# Altium project MainBoard.PrjPcb (part 1 of 3)
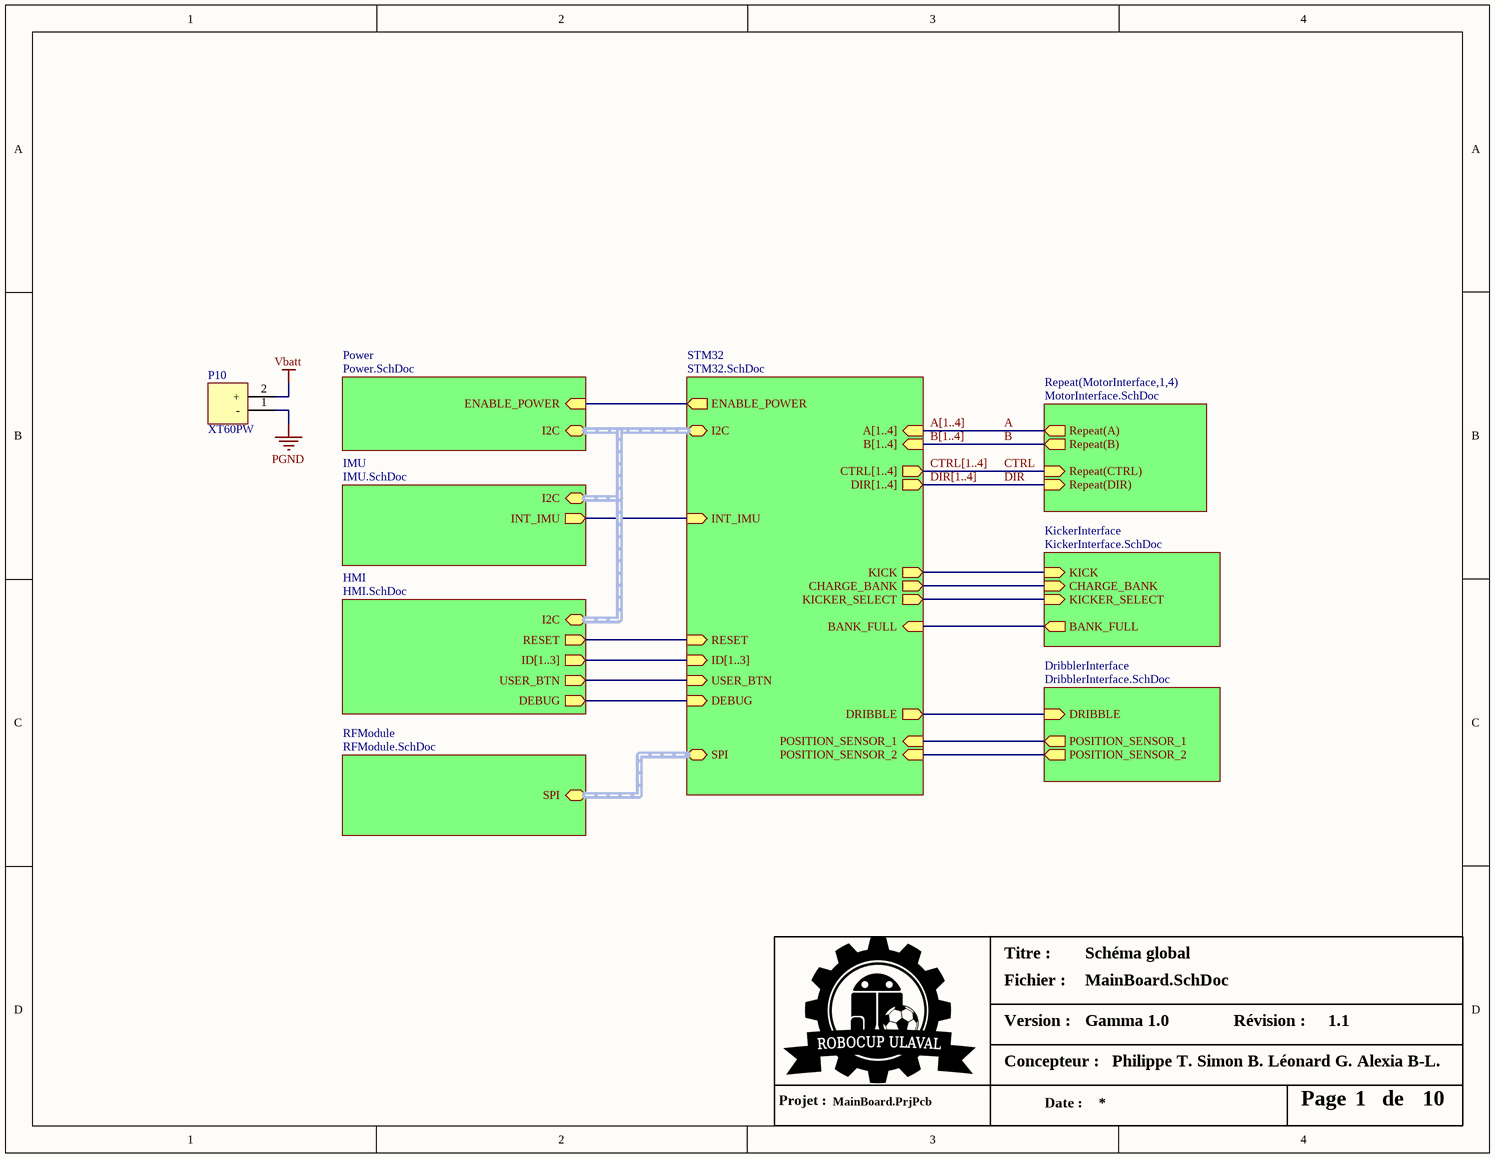
[diagram p0: MainBoard.SchDoc]
10 sheets, 173 parts. Net scope: hierarchical (ports join the sheet entries above them; power ports are global).
Board file: PCB_MainBoard.PcbDoc
Sheets:
  MainBoard.SchDoc
    Power = Power.SchDoc
    MotorInterface1 = MotorInterface.SchDoc
    MotorInterface2 = MotorInterface.SchDoc
    MotorInterface3 = MotorInterface.SchDoc
    MotorInterface4 = MotorInterface.SchDoc
    KickerInterface = KickerInterface.SchDoc
    DribblerInterface = DribblerInterface.SchDoc
    HMI = HMI.SchDoc
    IMU = IMU.SchDoc
    RFModule = RFModule.SchDoc
    STM32 = STM32.SchDoc
      MCU = MCU.SchDoc

## Sheet MainBoard.SchDoc: Schéma global
size Letter; Organization: Robocup Ulaval; DocumentNumber: 1; Revision: 1.1; SheetNumber: 1; SheetTotal: 10; Version: Gamma 1.0; Conceptor: Philippe T. Simon B. Léonard G. Alexia B-L.

### Parts
P10  XT60PW  [XT60PW]

### Sub-sheets
DribblerInterface = DribblerInterface.SchDoc: DRIBBLE (in), POSITION_SENSOR_2 (out), POSITION_SENSOR_1 (out)
HMI = HMI.SchDoc: I2C (harness I2C), ID[1..3] (out), RESET (out), USER_BTN (out), DEBUG (out)
IMU = IMU.SchDoc: I2C (harness I2C), INT_IMU (out)
KickerInterface = KickerInterface.SchDoc: KICK (in), BANK_FULL (out), CHARGE_BANK (in), KICKER_SELECT (in)
Power = Power.SchDoc: ENABLE_POWER (in), I2C (harness I2C)
Repeat(MotorInterface,1,4) = MotorInterface.SchDoc: Repeat(A) (out), Repeat(B) (out), Repeat(CTRL) (in), Repeat(DIR) (in)
RFModule = RFModule.SchDoc: SPI (harness SPI)
STM32 = STM32.SchDoc: A[1..4] (in), B[1..4] (in), ID[1..3] (in), I2C (harness I2C), SPI (harness SPI), ENABLE_POWER (out), CTRL[1..4] (out), DIR[1..4] (out), KICK (out), BANK_FULL (in), CHARGE_BANK (out), POSITION_SENSOR_1 (in), POSITION_SENSOR_2 (in), DRIBBLE (out), RESET (in), INT_IMU (in), KICKER_SELECT (out), USER_BTN (in), DEBUG (in)

### Nets
PGND: P10.1(-)
Vbatt: P10.2(+)
A: sheet Repeat(MotorInterface,1,4)/Repeat(A)
B: sheet Repeat(MotorInterface,1,4)/Repeat(B)
BANK_FULL: sheet KickerInterface/BANK_FULL, sheet STM32/BANK_FULL
CHARGE_BANK: sheet KickerInterface/CHARGE_BANK, sheet STM32/CHARGE_BANK
CTRL: sheet Repeat(MotorInterface,1,4)/Repeat(CTRL)
DEBUG: sheet HMI/DEBUG, sheet STM32/DEBUG
DIR: sheet Repeat(MotorInterface,1,4)/Repeat(DIR)
DRIBBLE: sheet DribblerInterface/DRIBBLE, sheet STM32/DRIBBLE
ENABLE_POWER: sheet Power/ENABLE_POWER, sheet STM32/ENABLE_POWER
IMU_IRQ: sheet IMU/INT_IMU, sheet STM32/INT_IMU
KICK: sheet KickerInterface/KICK, sheet STM32/KICK
KICKER_SELECT: sheet KickerInterface/KICKER_SELECT, sheet STM32/KICKER_SELECT
POSITION_SENSOR_1: sheet DribblerInterface/POSITION_SENSOR_1, sheet STM32/POSITION_SENSOR_1
POSITION_SENSOR_2: sheet DribblerInterface/POSITION_SENSOR_2, sheet STM32/POSITION_SENSOR_2
RESET: sheet HMI/RESET, sheet STM32/RESET
USER_BTN: sheet HMI/USER_BTN, sheet STM32/USER_BTN

### Buses and harness runs
bus A[1..4] = sheet STM32/A[1..4]
bus B[1..4] = sheet STM32/B[1..4]
bus CTRL[1..4] = sheet STM32/CTRL[1..4]
bus DIR[1..4] = sheet STM32/DIR[1..4]
bus sheet HMI/ID[1..3] = sheet STM32/ID[1..3]
harness sheet HMI/I2C = sheet IMU/I2C = sheet Power/I2C = sheet STM32/I2C
harness sheet RFModule/SPI = sheet STM32/SPI

### Notes on the sheet
- Titre :
- Version :
- Fichier :
- Révision :
- Projet :
- Concepteur :
- Date :
- Page
- de

### Library data of the parts
P10 = XT60PW: XT60PW connector

## Sheet Power.SchDoc: Power supply unit
size A4; Organization: Robocup Ulaval; DocumentNumber: 4; Revision: 1.0; SheetNumber: 4; SheetTotal: 10; Conceptor: Philippe T. Simon B. Léonard G. Alexia B-L.; Version: Gamma 1.0; PageSetup: Record=PageOptions|CenterHorizontal=True|CenterVertical=True|PrintScale=1.00|XCorrection=1.00|YCorrection=1.00|PrintKind=1|BorderSize=5000000|LeftOffset=0|BottomOffset=0|Orientation=2|PaperLength=1000|PaperWidth=1000|Scale=100|PaperSource=7|PrintQuality=-4|MediaType=1|DitherType=10|PaperKind=A4 Small|PrintScaleMode=1
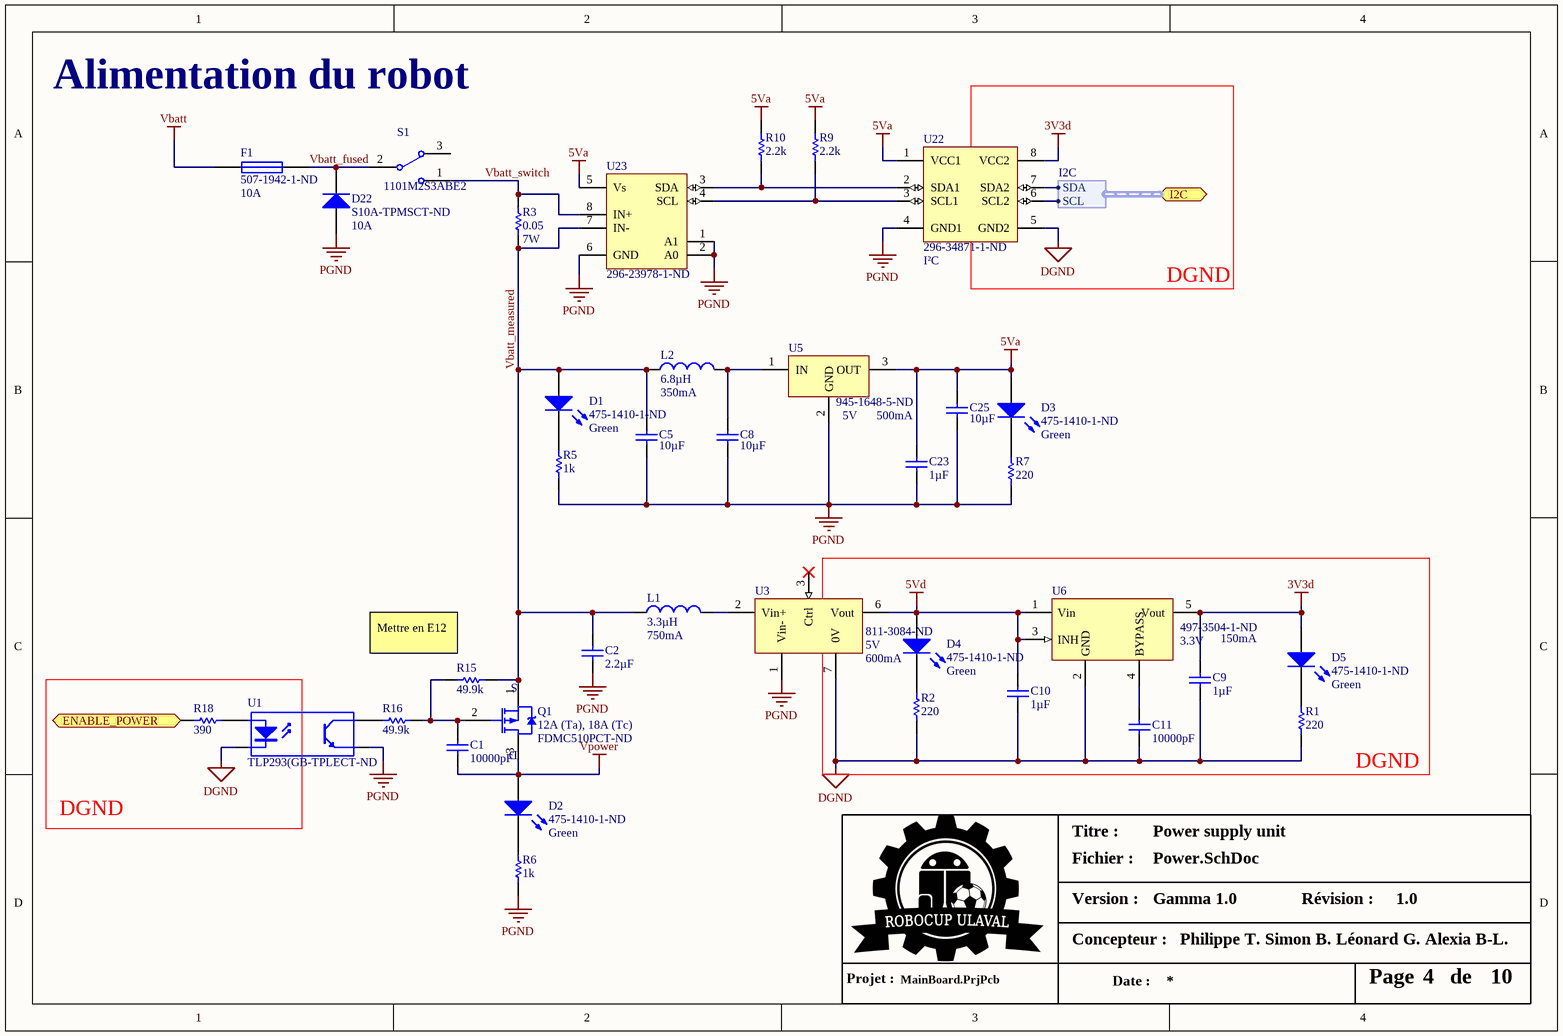
[diagram p1: Power.SchDoc]

### Parts
C1  Capacitance: 10000pF  [0603]  (hidden comment: GRM188R71H103KA01D)
C2  Capacitance: 2.2µF  [0805]  (hidden comment: CL21B225KAFNNWE)
C5  Capacitance: 10µF  [1206]  (hidden comment: GMK316AB7106KL-TR)
C8  Capacitance: 10µF  [1206]  (hidden comment: GMK316AB7106KL-TR)
C9  Capacitance: 1µF  [0805]  (hidden comment: CL21B105KBFNFNE)
C10  Capacitance: 1µF  [0805]  (hidden comment: CL21B105KBFNFNE)
C11  Capacitance: 10000pF  [0603]  (hidden comment: GRM188R71H103KA01D)
C23  Capacitance: 1µF  [0805]  (hidden comment: CL21B105KBFNFNE)
C25  Capacitance: 10µF  [1206]  (hidden comment: GMK316AB7106KL-TR)
D1  Supplier Part Number 1: 475-1410-1-ND  Color: Green  [0805]  (hidden comment: LG R971-KN-1)
D2  Supplier Part Number 1: 475-1410-1-ND  Color: Green  [0805]  (hidden comment: LG R971-KN-1)
D3  Supplier Part Number 1: 475-1410-1-ND  Color: Green  [0805]  (hidden comment: LG R971-KN-1)
D4  Supplier Part Number 1: 475-1410-1-ND  Color: Green  [0805]  (hidden comment: LG R971-KN-1)
D5  Supplier Part Number 1: 475-1410-1-ND  Color: Green  [0805]  (hidden comment: LG R971-KN-1)
D22  Supplier Part Number 1: S10A-TPMSCT-ND  Current - Average Rectified (Io): 10A  [SMC]  (hidden comment: S10A-TP)
F1  Supplier Part Number 1: 507-1942-1-ND  Current Rating: 10A  [1206]  (hidden comment: C1H 10)
L1  Inductance: 3.3µH  Current Rating: 750mA  [0805]  (hidden comment: MLZ2012N3R3LT000)
L2  Inductance: 6.8µH  Current Rating: 350mA  [0805]  (hidden comment: MLZ2012M6R8WT000)
Q1  Current - Continuous Drain (Id) @ 25°C: 12A (Ta), 18A (Tc)  Supplier Part Number 1: FDMC510PCT-ND  [PowerPAK 1212-8]  (hidden comment: FDMC510P)
R1  Resistance (Ohms): 220  [1206]  (hidden comment: RC1206JR-07220RL)
R2  Resistance (Ohms): 220  [1206]  (hidden comment: RC1206JR-07220RL)
R3  Resistance (Ohms): 0.05  Power (Watts): 7W  [RESC7146X15N]  (hidden comment: WSHM2818R0500FEA)
R5  Resistance (Ohms): 1k  [1206]  (hidden comment: RNCP1206FTD1K00)
R6  Resistance (Ohms): 1k  [1206]  (hidden comment: RC0603FR-072K2L)
R7  Resistance (Ohms): 220  [1206]  (hidden comment: RC1206JR-07220RL)
R9  Resistance (Ohms): 2.2k  [0603]  (hidden comment: RC0603FR-072K2L)
R10  Resistance (Ohms): 2.2k  [0603]  (hidden comment: RC0603FR-072K2L)
R15  Resistance (Ohms): 49.9k  [0603]  (hidden comment: RC0603FR-0749K9L)
R16  Resistance (Ohms): 49.9k  [0603]  (hidden comment: RC0603FR-0749K9L)
R18  Resistance (Ohms): 390  [0603]  (hidden comment: RC0603JR-07390RL)
S1  1101M2S3ABE2  [C&K Switch]
U1  Supplier Part Number 1: TLP293(GB-TPLECT-ND  [SOIC127P700X220-4N]  (hidden comment: TLP293(GB-TPL,E)
U3  Supplier Part Number 1: 811-3084-ND  Voltage - Output 1: 5V  Current - Output (Max): 600mA  [NCS3S]  (hidden comment: NCS3S1205SC)
U5  Supplier Part Number 1: 945-1648-5-ND  Voltage - Output 1: 5V  Current - Output (Max): 500mA  [3-SIP MOdule]  (hidden comment: R-78E5.0-0.5)
U6  Supplier Part Number 1: 497-3504-1-ND  Voltage - Output: 3.3V  Current - Output: 150mA  [SOT-23-5]  (hidden comment: LD3985M33R)
U22  Supplier Part Number 1: 296-34871-1-ND  Type: I²C  [SOIC127P600X175-8N]  (hidden comment: ISO1540DR)
U23  Supplier Part Number 1: 296-23978-1-ND  [SOIC127P600X175-8N]  (hidden comment: INA219AIDR)

### Blocks framed on the sheet
DGND: U22
DGND: C9-C11 D4 D5 R1 R2 U6
DGND: R18

### Ports
ENABLE_POWER (in), I2C (harness I2C)

### Harnesses
I2C: SCL, SDA

### Nets
3V3d: C9.2 D5.1(A) U6.5(Vout) U22.8(VCC2)
5Va: C23.2 C25.2 D3.1(A) R9.2 R10.2 U5.3(OUT) U22.1(VCC1) U23.5(Vs)
5Vd: C10.2 D4.1(A) U3.6(Vout) U6.1(Vin) U6.3(INH)
DGND: C9.1 C10.1 C11.1 R1.1 R2.1 U1.2(K) U3.7(0V) U6.2(GND) U22.5(GND2)
PGND: C2.1 C5.1 C8.1 C23.1 C25.1 D22.1(A) R5.1 R6.1 R7.1 U1.3(E) U3.1(Vin-) U5.2(GND) U22.4(GND1) U23.1(A1) U23.2(A0) U23.6(GND)
Vbatt: F1.1
Vpower: C1.1 D2.1(A) Q1.3(D)
ENABLE_POWER: R18.1 ; port ENABLE_POWER
SCL: U22.6(SCL2) ; port I2C.SCL
SDA: U22.7(SDA2) ; port I2C.SDA
Vbatt_fused: D22.2(K) F1.2 S1.2
Vbatt_measured: C2.2 C5.2 D1.1(A) L1.1 L2.1 Q1.1(S) R3.1 R15.2 U23.7(IN-)
Vbatt_switch: R3.2 S1.1 U23.8(IN+)
NetC1_2: C1.2 Q1.2(G) R15.1 R16.2
NetC8_2: C8.2 L2.2 U5.1(IN)
NetC11_2: C11.2 U6.4(BYPASS)
NetD1_2: D1.2(K) R5.2
NetD2_2: D2.2(K) R6.2
NetD3_2: D3.2(K) R7.2
NetD4_2: D4.2(K) R2.2
NetD5_2: D5.2(K) R1.2
NetL1_2: L1.2 U3.2(Vin+)
NetR9_1: R9.1 U22.3(SCL1) U23.4(SCL)
NetR10_1: R10.1 U22.2(SDA1) U23.3(SDA)
NetR16_1: R16.1 U1.4(C)
NetR18_2: R18.2 U1.1(A)

Not connected (* = marked no-connect by the designer): S1 3; U3 3(Ctrl)*

### Notes on the sheet
- Alimentation du robot
- (near R15) Mettre en E12
- Titre :
- Version :
- Fichier :
- Révision :
- Projet :
- Concepteur :
- Date :
- Page
- de

### Library data of the parts
C1 C11 = GRM188R71H103KA01D: CAP CER 10000PF 50V X7R 0603; Manufacturer: Murata Electronics North America; Tolerance: ±10%; Supplier 1: Digi-Key; Manufacturer Part Number: GRM188R71H103KA01D; RoHS: RoHS Compliant; Category: Capacitors; Stock 1: 3064909; Pricing 1: 1=0.14, 10=0.027, 50=0.0142, 100=0.0121, 250=0.00988, 500=0.00848, 1000=0.00661 (CAD); Packaging: Cut Tape (CT); Voltage - Rated: 50V; Temperature Coefficient: X7R; Mounting Type: Surface Mount, MLCC; Operating Temperature: -55°C ~ 125°C; Applications: General Purpose; Ratings: -; Package / Case: 0603 (1608 Metric); Size / Dimension: 0.063" L x 0.031" W (1.60mm x 0.80mm); Height - Seated (Max): -; Thickness (Max): 0.035" (0.90mm); Lead Spacing: -; Features: -; Lead Style: -; ComponentLink1URL: http://www.murata.com/~/media/webrenewal/support/library/catalog/products/capacitor/mlcc/c02e.pdf; ComponentLink1Description: http://www.murata.com/~/media/webrenewal/support/library/catalog/products/capacitor/mlcc/c02e.pdf; Supplier Part Number 1: 490-1512-1-ND
C2 = CL21B225KAFNNWE: CAP CER 2.2UF 25V X7R 0805; Manufacturer: Samsung Electro-Mechanics America, Inc.; Tolerance: ±10%; Supplier 1: Digi-Key; Supplier Part Number 1: 1276-2955-1-ND; Manufacturer Part Number: CL21B225KAFNNWE; RoHS: RoHS Compliant; Category: Capacitors; Stock 1: 66081; Pricing 1: 1=0.3, 10=0.199, 25=0.1452, 50=0.1208, 100=0.1015, 500=0.07252, 1000=0.06163 (CAD); Packaging: Cut Tape (CT); Voltage - Rated: 25V; Temperature Coefficient: X7R; Mounting Type: Surface Mount, MLCC; Operating Temperature: -55°C ~ 125°C; Applications: General Purpose; Ratings: -; Package / Case: 0805 (2012 Metric); Size / Dimension: 0.079" L x 0.049" W (2.00mm x 1.25mm); Height - Seated (Max): -; Thickness (Max): 0.053" (1.35mm); Lead Spacing: -; Features: -; Lead Style: -; ComponentLink1URL: http://media.digikey.com/pdf/Data%20Sheets/Samsung%20PDFs/CL21B225KAFNNWE_Spec.pdf; ComponentLink1Description: http://media.digikey.com/pdf/Data%20Sheets/Samsung%20PDFs/CL21B225KAFNNWE_Spec.pdf
C5 C8 C25 = GMK316AB7106KL-TR: CAP CER 10UF 35V X7R 1206; Manufacturer: Taiyo Yuden; Tolerance: ±10%; Supplier 1: Digi-Key; Supplier Part Number 1: 587-3007-1-ND; Manufacturer Part Number: GMK316AB7106KL-TR; RoHS: RoHS Compliant; Category: Capacitors; Stock 1: 108706; Pricing 1: 1=0.84, 10=0.697, 50=0.4996, 100=0.4371, 250=0.34344, 500=0.31222, 1000=0.24978 (CAD); Packaging: Cut Tape (CT); Voltage - Rated: 35V; Temperature Coefficient: X7R; Mounting Type: Surface Mount, MLCC; Operating Temperature: -55°C ~ 125°C; Applications: General Purpose; Ratings: -; Package / Case: 1206 (3216 Metric); Size / Dimension: 0.126" L x 0.063" W (3.20mm x 1.60mm); Height - Seated (Max): -; Thickness (Max): 0.071" (1.80mm); Lead Spacing: -; Features: -; Lead Style: -; ComponentLink1URL: http://media.digikey.com/pdf/Data%20Sheets/Taiyo%20Yuden%20PDFs%20URL%20links/GMK316AB7106KL-TR_ProdSpec.pdf; ComponentLink1Description: http://media.digikey.com/pdf/Data%20Sheets/Taiyo%20Yuden%20PDFs%20URL%20links/GMK316AB7106KL-TR_ProdSpec.pdf
C9 C10 C23 = CL21B105KBFNFNE: CAP CER 1UF 50V X7R 0805; Manufacturer: Samsung Electro-Mechanics America, Inc.; Tolerance: ±10%; Supplier 1: Digi-Key; Manufacturer Part Number: CL21B105KBFNFNE; RoHS: RoHS Compliant; Stock 1: 21699; Pricing 1: 1=0.27, 10=0.186, 25=0.14, 50=0.1072, 100=0.0884, 500=0.06238, 1000=0.05123 (CAD); Packaging: Cut Tape (CT); Voltage - Rated: 50V; Temperature Coefficient: X7R; Mounting Type: Surface Mount, MLCC; Operating Temperature: -55°C ~ 125°C; Applications: General Purpose; Ratings: -; Package / Case: 0805 (2012 Metric); Size / Dimension: 0.079" L x 0.049" W (2.00mm x 1.25mm); Height - Seated (Max): -; Thickness (Max): 0.053" (1.35mm); Lead Spacing: -; Features: -; Lead Style: -; ComponentLink1URL: http://www.samsungsem.com/kr/support/product-search/mlcc/CL21B105KBFNFNE.jsp; ComponentLink1Description: http://www.samsungsem.com/kr/support/product-search/mlcc/CL21B105KBFNFNE.jsp; Supplier Part Number 1: 1276-2928-1-ND; Category: Capacitors
D1-D5 = LG R971-KN-1: LED GREEN DIFFUSED 0805 SMD; Manufacturer: OSRAM Opto Semiconductors Inc.; Lens Color: White; Millicandela Rating: 26.05mcd; Lens Style/Size: Rectangle with Flat Top, 1.30mm x 1.25mm; Voltage - Forward (Vf) (Typ): 2.2V; Current - Test: 20mA; Viewing Angle: 160°; Wavelength - Dominant: 570nm; Wavelength - Peak: 572nm; Supplier 1: Digi-Key; Manufacturer Part Number: LG R971-KN-1; RoHS: RoHS Compliant; Category: Optoelectronics; Stock 1: 315869; Pricing 1: 1=0.37, 10=0.267, 25=0.1972, 100=0.141, 250=0.09588, 500=0.0846, 1000=0.06626 (CAD); Packaging: Cut Tape (CT); Lens Transparency: Diffused; Mounting Type: Surface Mount; Features: -; Package / Case: 0805 (2012 Metric); Supplier Device Package: *; Size / Dimension: 2.00mm L x 1.25mm W; Height (Max): 0.90mm; ComponentLink1URL: http://www.osram-os.com/Graphics/XPic9/00078860_0.pdf; ComponentLink1Description: http://www.osram-os.com/Graphics/XPic9/00078860_0.pdf
D22 = S10A-TP: DIODE GEN PURP 50V 10A DO214AB; Manufacturer: Micro Commercial Co; Diode Type: Standard; Voltage - Forward (Vf) (Max) @ If: 1.2V @ 10A; Speed: Standard Recovery >500ns, > 200mA (Io); Current - Reverse Leakage @ Vr: 10µA @ 50V; Supplier 1: Digi-Key; Manufacturer Part Number: S10A-TP; RoHS: RoHS Compliant; Category: Discrete Semiconductor Products; Stock 1: 16594; Pricing 1: 1=0.88, 10=0.769, 25=0.6808, 100=0.5932, 250=0.51624, 500=0.43934 (CAD); Packaging: Cut Tape (CT); Voltage - DC Reverse (Vr) (Max): 50V; Reverse Recovery Time (trr): -; Capacitance @ Vr, F: -; Mounting Type: Surface Mount; Package / Case: DO-214AB, SMC; Supplier Device Package: DO-214AB, (SMC); Operating Temperature - Junction: -55°C ~ 150°C; ComponentLink1URL: http://www.mccsemi.com/up_pdf/S10A~S10M(HSMC).PDF; ComponentLink1Description: http://www.mccsemi.com/up_pdf/S10A~S10M(HSMC).PDF
F1 = C1H 10: FUSE BOARD MNT 10A 125VAC 32VDC; Manufacturer: Bel Fuse Inc.; Fuse Type: Board Mount (Cartridge Style Excluded); Voltage Rating - AC: 125V; Voltage Rating - DC: 32V; Response Time: Fast; Breaking Capacity @ Rated Voltage: 150A; Melting I²t: 5.9; Approvals: cURus; DC Cold Resistance: 0.0039 Ohm; Supplier 1: Digi-Key; Manufacturer Part Number: C1H 10; RoHS: RoHS Compliant; Category: Circuit Protection; Stock 1: 8694; Pricing 1: 1=0.47, 10=0.438, 25=0.4036, 100=0.363, 250=0.3232, 500=0.26932, 1000=0.25521, 2500=0.22828 (CAD); Packaging: Cut Tape (CT); Package / Case: 1206 (3216 Metric); Mounting Type: Surface Mount; Operating Temperature: -55°C ~ 125°C; Color: -; Size / Dimension: 0.126" L x 0.062" W x 0.026" H (3.20mm x 1.58mm x 0.65mm); ComponentLink1URL: http://belfuse.com/pdfs/C1H.pdf; ComponentLink1Description: http://belfuse.com/pdfs/C1H.pdf
L1 = MLZ2012N3R3LT000: FIXED IND 3.3UH 750MA 150 MOHM; Manufacturer: TDK Corporation; Type: Multilayer; Material - Core: Ferrite; Tolerance: ±20%; Current - Saturation: 130mA; Shielding: Shielded; DC Resistance (DCR): 195 mOhm Max; Frequency - Self Resonant: 90MHz; Frequency - Test: 2MHz; Supplier 1: Digi-Key; Supplier Part Number 1: 445-6759-1-ND; Manufacturer Part Number: MLZ2012N3R3LT000; RoHS: RoHS Compliant; Category: Inductors, Coils, Chokes; Stock 1: 9368; Pricing 1: 1=0.21, 10=0.189, 50=0.1478, 100=0.1325, 500=0.11356, 1000=0.09841 (CAD); Packaging: Cut Tape (CT); Q @ Freq: -; Ratings: -; Operating Temperature: -55°C ~ 125°C; Mounting Type: Surface Mount; Package / Case: 0805 (2012 Metric); Size / Dimension: 0.079" L x 0.049" W (2.00mm x 1.25mm); Height - Seated (Max): 0.041" (1.05mm); ComponentLink1URL: https://product.tdk.com/info/en/catalog/datasheets/inductor_commercial_decoupling_mlz2012_en.pdf; ComponentLink1Description: https://product.tdk.com/info/en/catalog/datasheets/inductor_commercial_decoupling_mlz2012_en.pdf
L2 = MLZ2012M6R8WT000: FIXED IND 6.8UH 350MA 400 MOHM; Manufacturer: TDK Corporation; Type: Multilayer; Material - Core: Ferrite; Tolerance: ±20%; Current - Saturation: 220mA; Shielding: Shielded; DC Resistance (DCR): 520 mOhm Max; Frequency - Test: 2MHz; Supplier 1: Digi-Key; Supplier Part Number 1: 445-6402-1-ND; Manufacturer Part Number: MLZ2012M6R8WT000; RoHS: RoHS Compliant; Category: Inductors, Coils, Chokes; Packaging: Tape & Reel (TR); Q @ Freq: -; Frequency - Self Resonant: -; Ratings: -; Operating Temperature: -55°C ~ 125°C; Mounting Type: Surface Mount; Package / Case: 0805 (2012 Metric); Size / Dimension: 0.079" L x 0.049" W (2.00mm x 1.25mm); Height - Seated (Max): 0.057" (1.45mm); ComponentLink1URL: https://product.tdk.com/info/en/catalog/datasheets/inductor_commercial_decoupling_mlz2012_en.pdf; ComponentLink1Description: https://product.tdk.com/info/en/catalog/datasheets/inductor_commercial_decoupling_mlz2012_en.pdf
Q1 = FDMC510P: MOSFET P-CH 20V 18A 8-MLP; Manufacturer: Fairchild Semiconductor; FET Type: MOSFET P-Channel, Metal Oxide; FET Feature: Standard; Rds On (Max) @ Id, Vgs: 8 mOhm @ 12A, 4.5V; Vgs(th) (Max) @ Id: 1V @ 250µA; Gate Charge (Qg) @ Vgs: 116nC @ 4.5V; Input Capacitance (Ciss) @ Vds: 7860pF @ 10V; Power - Max: 2.3W; Supplier 1: Digi-Key; Manufacturer Part Number: FDMC510P; RoHS: RoHS Compliant; Category: Discrete Semiconductor Products; Stock 1: 32424; Pricing 1: 1=2.03, 10=1.816, 100=1.4153, 500=1.17042, 1000=0.92559 (CAD); Packaging: Cut Tape (CT); Drain to Source Voltage (Vdss): 20V; Operating Temperature: -55°C ~ 150°C (TJ); Mounting Type: Surface Mount; Package / Case: 8-PowerWDFN; Supplier Device Package: 8-MLP (3.3x3.3); ComponentLink1URL: http://www.fairchildsemi.com/datasheets/FD/FDMC510P.pdf; ComponentLink1Description: http://www.fairchildsemi.com/datasheets/FD/FDMC510P.pdf
R1 R2 R7 = RC1206JR-07220RL: RES SMD 220 OHM 5% 1/4W 1206; Manufacturer: Yageo; Power (Watts): 0.25W, 1/4W; Temperature Coefficient: ±100ppm/°C; Supplier 1: Digi-Key; Manufacturer Part Number: RC1206JR-07220RL; RoHS: RoHS Compliant; Category: Resistors; Stock 1: 224548; Pricing 1: 1=0.15, 10=0.036, 25=0.0268, 100=0.015, 250=0.0114, 500=0.00912, 1000=0.00671, 2500=0.00582 (CAD); Packaging: Cut Tape (CT); Tolerance: ±5%; Composition: Thick Film; Features: Moisture Resistant; Operating Temperature: -55°C ~ 155°C; Package / Case: 1206 (3216 Metric); Supplier Device Package: 1206; Size / Dimension: 0.122" L x 0.063" W (3.10mm x 1.60mm); Height: 0.026" (0.65mm); Number of Terminations: 2; ComponentLink1URL: http://www.yageo.com/documents/recent/PYu-RC_Group_51_RoHS_L_04.pdf; ComponentLink1Description: http://www.yageo.com/documents/recent/PYu-RC_Group_51_RoHS_L_04.pdf; Supplier Part Number 1: 311-220ERCT-ND
R3 = WSHM2818R0500FEA: RES SMD 0.05 OHM 1% 7W 2818; Manufacturer: Vishay Dale; Temperature Coefficient: ±75ppm/°C; Supplier 1: Digi-Key; Supplier Part Number 1: 541-2633-1-ND; Manufacturer Part Number: WSHM2818R0500FEA; RoHS: RoHS Compliant; Category: Resistors; Stock 1: 1975; Pricing 1: 1=2.04, 10=1.808, 25=1.6612, 50=1.5156, 100=1.3116, 250=1.10756, 500=0.93264, 1000=0.77526 (CAD); Packaging: Cut Tape (CT); Tolerance: ±1%; Composition: Metal Element; Features: Automotive AEC-Q200, Current Sense, Moisture Resistant, Pulse Withstanding; Operating Temperature: -65°C ~ 170°C; Package / Case: 2818; Supplier Device Package: 2818; Size / Dimension: 0.280" L x 0.181" W (7.10mm x 4.60mm); Height: 0.069" (1.75mm); Number of Terminations: 2; ComponentLink1URL: http://www.vishay.com/docs/30188/wshm2818.pdf; ComponentLink1Description: http://www.vishay.com/docs/30188/wshm2818.pdf
R5 R6 = RNCP1206FTD1K00: RES SMD 1K OHM 1% 1/2W 1206; Manufacturer: Stackpole Electronics Inc.; Temperature Coefficient: ±100ppm/°C; Power (Watts): 0.5W, 1/2W; Supplier 1: Digi-Key; Manufacturer Part Number: RNCP1206FTD1K00; RoHS: RoHS Compliant; Category: Resistors; Stock 1: 13665; Pricing 1: 1=0.15, 10=0.074, 50=0.041, 100=0.0302, 250=0.02312, 500=0.01848, 1000=0.0136, 2500=0.0118 (CAD); Packaging: Cut Tape (CT); Part Status: Active; Tolerance: ±1%; Composition: Thin Film; Features: Anti-Sulfur, Moisture Resistant; Operating Temperature: -55°C ~ 155°C; Package / Case: 1206 (3216 Metric); Supplier Device Package: 1206; Size / Dimension: 0.122" L x 0.059" W (3.10mm x 1.50mm); Height: 0.024" (0.60mm); Number of Terminations: 2; Failure Rate: -; ComponentLink1URL: http://www.seielect.com/catalog/SEI-RNCP.pdf; ComponentLink1Description: http://www.seielect.com/catalog/SEI-RNCP.pdf; Supplier Part Number 1: RNCP1206FTD1K00CT-ND
R9 R10 = RC0603FR-072K2L: RES SMD 2.2K OHM 1% 1/10W 0603; Manufacturer: Yageo; Power (Watts): 0.1W, 1/10W; Temperature Coefficient: ±100ppm/°C; Supplier 1: Digi-Key; Manufacturer Part Number: RC0603FR-072K2L; RoHS: RoHS Compliant; Category: Resistors; Stock 1: 297758; Pricing 1: 1=0.15, 10=0.021, 25=0.0152, 100=0.0086, 250=0.0066, 500=0.00526, 1000=0.00389, 2500=0.00337 (CAD); Packaging: Cut Tape (CT); Tolerance: ±1%; Composition: Thick Film; Features: Moisture Resistant; Operating Temperature: -55°C ~ 155°C; Package / Case: 0603 (1608 Metric); Supplier Device Package: 0603; Size / Dimension: 0.063" L x 0.031" W (1.60mm x 0.80mm); Height: 0.022" (0.55mm); Number of Terminations: 2; ComponentLink1URL: http://www.yageo.com/documents/recent/PYu-RC_Group_51_RoHS_L_04.pdf; ComponentLink1Description: http://www.yageo.com/documents/recent/PYu-RC_Group_51_RoHS_L_04.pdf; Supplier Part Number 1: 311-2.20KHRCT-ND
R15 R16 = RC0603FR-0749K9L: RES SMD 49.9K OHM 1% 1/10W 0603; Manufacturer: Yageo; Power (Watts): 0.1W, 1/10W; Temperature Coefficient: ±100ppm/°C; Supplier 1: Digi-Key; Manufacturer Part Number: RC0603FR-0749K9L; RoHS: RoHS Compliant; Category: Resistors; Stock 1: 1514497; Pricing 1: 1=0.15, 10=0.021, 25=0.0152, 100=0.0086, 250=0.0066, 500=0.00526, 1000=0.00389, 2500=0.00337 (CAD); Packaging: Cut Tape (CT); Tolerance: ±1%; Composition: Thick Film; Features: Moisture Resistant; Operating Temperature: -55°C ~ 155°C; Package / Case: 0603 (1608 Metric); Supplier Device Package: 0603; Size / Dimension: 0.063" L x 0.031" W (1.60mm x 0.80mm); Height: 0.022" (0.55mm); Number of Terminations: 2; ComponentLink1URL: http://www.yageo.com/documents/recent/PYu-RC_Group_51_RoHS_L_04.pdf; ComponentLink1Description: http://www.yageo.com/documents/recent/PYu-RC_Group_51_RoHS_L_04.pdf; Supplier Part Number 1: 311-49.9KHRCT-ND
R18 = RC0603JR-07390RL: RES SMD 390 OHM 5% 1/10W 0603; Manufacturer: Yageo; Power (Watts): 0.1W, 1/10W; Temperature Coefficient: ±100ppm/°C; Supplier 1: Digi-Key; Manufacturer Part Number: RC0603JR-07390RL; RoHS: RoHS Compliant; Category: Resistors; Stock 1: 718727; Pricing 1: 1=0.15, 10=0.017, 25=0.012, 100=0.0067, 250=0.00508, 500=0.00408, 1000=0.003, 2500=0.0026 (CAD); Packaging: Cut Tape (CT); Tolerance: ±5%; Composition: Thick Film; Features: Moisture Resistant; Operating Temperature: -55°C ~ 155°C; Package / Case: 0603 (1608 Metric); Supplier Device Package: 0603; Size / Dimension: 0.063" L x 0.031" W (1.60mm x 0.80mm); Height: 0.022" (0.55mm); Number of Terminations: 2; ComponentLink1URL: http://www.yageo.com/documents/recent/PYu-RC_Group_51_RoHS_L_04.pdf; ComponentLink1Description: http://www.yageo.com/documents/recent/PYu-RC_Group_51_RoHS_L_04.pdf; Supplier Part Number 1: 311-390GRCT-ND
S1 = 1101M2S3ABE2: SWITCH SLIDE SPDT 0.4VA 20V; Manufacturer: C&K Components; Contact Timing: Not Specified; Switch Function: On-On; Current Rating: 0.4VA (AC/DC); Actuator Type: Standard; Actuator Length: 4.72mm; Actuator Material: Polyamide (PA), Nylon; Switch Travel: 2.16mm; Electrical Life: 100,000 Cycles; Supplier 1: Digi-Key; Manufacturer Part Number: 1101M2S3ABE2; RoHS: RoHS Compliant; Category: Switches; Stock 1: 1611; Pricing 1: 1=6.09, 10=5.952, 25=5.6872, 50=5.026, 100=4.9598, 250=4.89372, 500=4.034, 1000=3.76947, 5000=3.51818 (CAD); Packaging: Bulk; Part Status: Active; Circuit: SPDT; Voltage Rating - AC: 20V; Voltage Rating - DC: 20V; Contact Material: Copper; Contact Finish: Gold; Mounting Type: Through Hole, Right Angle; Termination Style: PC Pin; Features: Black Actuator, Epoxy Sealed Terminals; Operating Temperature: -30°C ~ 65°C; Mechanical Life: -; Operating Force: -; ComponentLink1URL: http://www.ck-components.com/media/1429/1000.pdf; ComponentLink1Description: http://www.ck-components.com/media/1429/1000.pdf; Supplier Part Number 1: CKN5005-ND
U1 = TLP293(GB-TPL,E: OPTOISOLATOR 3.75KV TRANS 4-SO; Manufacturer: Toshiba Semiconductor and Storage; Number of Channels: 1; Voltage - Isolation: 3750Vrms; Current Transfer Ratio (Min): 100% @ 5mA; Current Transfer Ratio (Max): 600% @ 5mA; Turn On / Turn Off Time (Typ): 3µs, 3µs; Rise / Fall Time (Typ): 2µs, 3µs; Input Type: DC; Output Type: Transistor; Voltage - Output (Max): 80V; Current - Output / Channel: 50mA; Voltage - Forward (Vf) (Typ): 1.25V; Vce Saturation (Max): 300mV; Supplier 1: Digi-Key; Manufacturer Part Number: TLP293(GB-TPL,E; RoHS: RoHS Compliant; Category: Isolators; Stock 1: 34284; Pricing 1: 1=0.74, 10=0.536, 25=0.438, 100=0.3503, 250=0.29564, 500=0.2518, 1000=0.19706 (CAD); Packaging: Cut Tape (CT); Current - DC Forward (If) (Max): 50mA; Operating Temperature: -55°C ~ 125°C; Mounting Type: Surface Mount; Package / Case: 4-SOIC (0.179", 4.55mm); Supplier Device Package: 4-SO; ComponentLink1URL: https://toshiba.semicon-storage.com/info/docget.jsp?did=14419&prodName=TLP293; ComponentLink1Description: https://toshiba.semicon-storage.com/info/docget.jsp?did=14419&prodName=TLP293
U3 = NCS3S1205SC: DC/DC CONVERTER 5V 3W; Manufacturer: Murata Power Solutions Inc.; Number of Outputs: 1; Voltage - Input (Min): 9V; Voltage - Input (Max): 36V; Voltage - Isolation: 1.5kV (1500V); Efficiency: 82%; Supplier 1: Digi-Key; Manufacturer Part Number: NCS3S1205SC; RoHS: RoHS Compliant; Category: Power Supplies - Board Mount; Stock 1: 0; Pricing 1: 1=15.64, 5=15.568, 10=15.455, 25=15.2844, 50=14.9004, 100=14.1611, 250=13.2512, 500=12.35548, 1000=12.29145 (CAD); Packaging: Tube; Type: Isolated Module; Voltage - Output 2: -; Voltage - Output 3: -; Power (Watts) - Manufacture Series: 3W; Applications: ITE (Commercial); Features: SCP; Mounting Type: Through Hole; Package / Case: 8-DIP Module (6 Leads); Size / Dimension: 0.86" L x 0.37" W x 0.44" H (22.0mm x 9.5mm x 11.3mm); Operating Temperature: -40°C ~ 85°C; Power (Watts) - Max: 3W; ComponentLink1URL: http://power.murata.com/data/power/ncl/kdc_ncs3.pdf; ComponentLink1Description: http://power.murata.com/data/power/ncl/kdc_ncs3.pdf
U5 = R-78E5.0-0.5: CONV DC/DC 5V 500MA OUT THRU; Manufacturer: Recom Power; Power (Watts) - Manufacture Series: 3W; Number of Outputs: 1; Voltage - Input (Min): 7V; Voltage - Input (Max): 28V; Efficiency: 92%; Supplier 1: Digi-Key; Manufacturer Part Number: R-78E5.0-0.5; RoHS: RoHS Compliant; Category: Power Supplies - Board Mount; Stock 1: 5464; Pricing 1: 1=4.04, 5=3.972, 10=3.916, 50=3.6854, 100=3.5701, 250=3.45496 (CAD); Packaging: Tube; Type: Linear Regulator Replacement; Voltage - Output 2: -; Voltage - Output 3: -; Voltage - Isolation: -; Applications: ITE (Commercial); Features: -; Mounting Type: Through Hole; Package / Case: 3-SIP Module; Size / Dimension: 0.46" L x 0.33" W x 0.41" H (11.6mm x 8.5mm x 10.4mm); Operating Temperature: -40°C ~ 85°C; Power (Watts) - Max: 3W; ComponentLink1URL: http://www.recom-power.com/pdf/Innoline/R-78Exx-0.5.pdf; ComponentLink1Description: http://www.recom-power.com/pdf/Innoline/R-78Exx-0.5.pdf
U6 = LD3985M33R: IC REG LDO 3.3V 0.15A SOT23-5; Manufacturer: STMicroelectronics; Regulator Topology: Positive Fixed; Voltage - Dropout (Typical): 0.06V @ 150mA; Number of Regulators: 1; Voltage - Input: Up to 6V; Current - Limit (Min): 300mA; Supplier 1: Digi-Key; Manufacturer Part Number: LD3985M33R; RoHS: RoHS Compliant; Category: Integrated Circuits (ICs); Stock 1: 6080; Pricing 1: 1=0.95, 10=0.815, 100=0.6081, 500=0.47766, 1000=0.36825 (CAD); Packaging: Cut Tape (CT); Operating Temperature: -40°C ~ 125°C; Mounting Type: Surface Mount; Package / Case: SC-74A, SOT-753; Supplier Device Package: SOT-23-5; ComponentLink1URL: http://www.st.com/web/en/resource/technical/document/datasheet/CD00003395.pdf; ComponentLink1Description: http://www.st.com/web/en/resource/technical/document/datasheet/CD00003395.pdf
U22 = ISO1540DR: DGTL ISO 2.5KV 2CH I2C 8SOIC; Manufacturer: Texas Instruments; Isolated Power: No; Number of Channels: 2; Inputs - Side 1/Side 2: 2/2; Channel Type: Bidirectional; Voltage - Isolation: 2500Vrms; Common Mode Transient Immunity (Min): 25kV/µs; Data Rate: 1Mbps; Pulse Width Distortion (Max): 80ns, 21ns; Voltage - Supply: 3 V ~ 5.5 V; Supplier 1: Digi-Key; Manufacturer Part Number: ISO1540DR; RoHS: RoHS Compliant; Category: Isolators; Stock 1: 4991; Pricing 1: 1=6.98, 10=6.27, 100=5.1441, 500=4.3763, 1000=3.19905 (CAD); Packaging: Cut Tape (CT); Technology: Capacitive Coupling; Propagation Delay tpLH / tpHL (Max): -; Rise / Fall Time (Typ): -; Operating Temperature: -40°C ~ 125°C; Package / Case: 8-SOIC (0.154", 3.90mm Width); Supplier Device Package: 8-SOIC; ComponentLink1URL: http://www.ti.com/lit/ds/symlink/iso1540.pdf; ComponentLink1Description: http://www.ti.com/lit/ds/symlink/iso1540.pdf
U23 = INA219AIDR: IC CURRENT MONITOR 1% 8SOIC; Manufacturer: Texas Instruments; Sensing Method: High-Side; Voltage - Input: 0 V ~ 26 V; Current - Output: 10mA; Supplier 1: Digi-Key; Manufacturer Part Number: INA219AIDR; RoHS: RoHS Compliant; Category: Integrated Circuits (ICs); Stock 1: 4871; Pricing 1: 1=3.11, 10=2.795, 100=2.2419, 500=1.84266, 1000=1.27962 (CAD); Packaging: Cut Tape (CT); Function: Current Monitor; Accuracy: ±1%; Operating Temperature: -40°C ~ 125°C; Mounting Type: Surface Mount; Package / Case: 8-SOIC (0.154", 3.90mm Width); Supplier Device Package: 8-SOIC; ComponentLink1URL: http://www.ti.com/lit/ds/symlink/ina219.pdf; ComponentLink1Description: http://www.ti.com/lit/ds/symlink/ina219.pdf

## Sheet MotorInterface.SchDoc: Connection vers moteurs
size Letter; Organization: Robocup Ulaval; DocumentNumber: 8; Revision: 1.0; SheetNumber: 8; SheetTotal: 10; Version: Gamma 1.0; Conceptor: Philippe T. Simon B. Léonard G. Alexia B-L.
Used 4 times, as channels MotorInterface1, MotorInterface2, MotorInterface3, MotorInterface4. Parts and nets are listed once, with the designators drawn on the sheet.
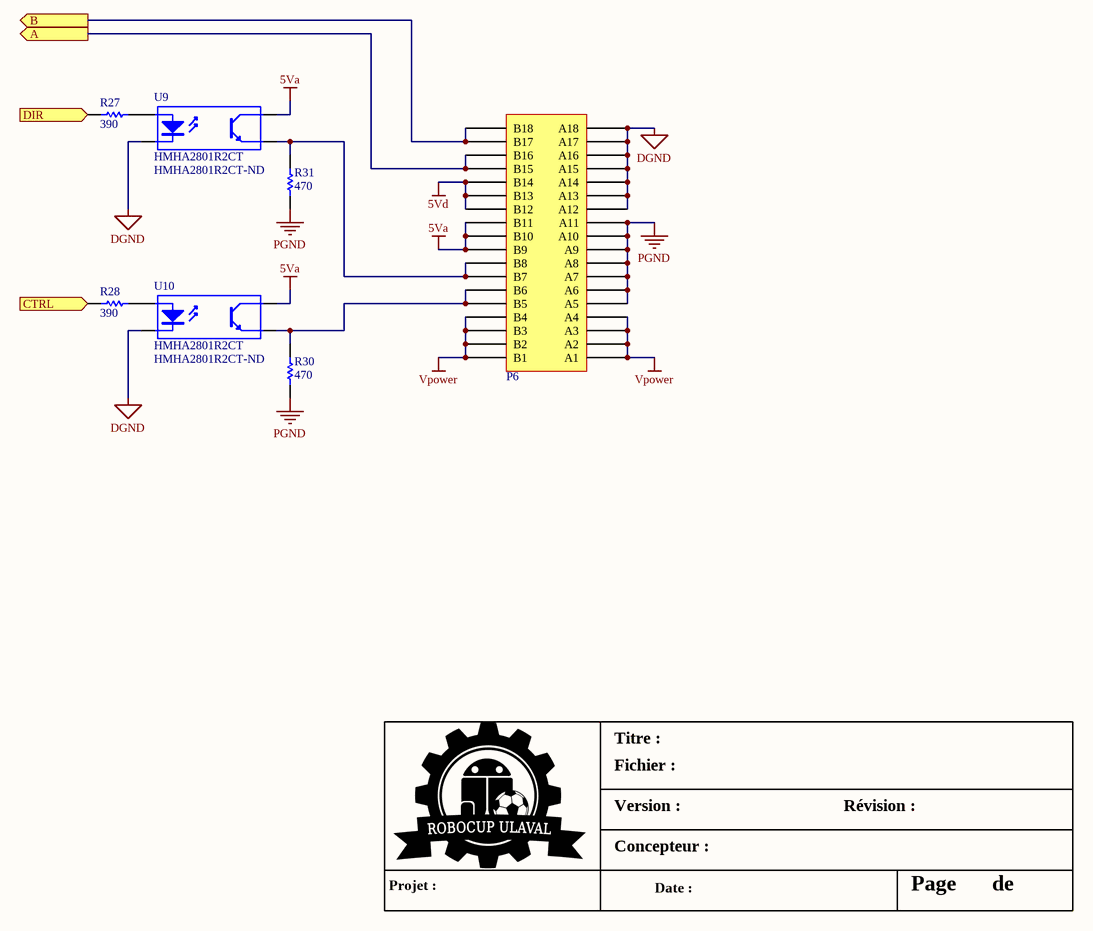
[diagram p2: MotorInterface.SchDoc]

### Parts
P6  0877159006  [0877159006]  (value not drawn)
R27  Resistance (Ohms): 390  [0603]  (hidden comment: RC0603JR-07390RL)
R28  Resistance (Ohms): 390  [0603]  (hidden comment: RC0603JR-07390RL)
R30  Resistance (Ohms): 470  [0603]  (hidden comment: RC0603JR-07470RL)
R31  Resistance (Ohms): 470  [0603]  (hidden comment: RC0603JR-07470RL)
U9  HMHA2801R2CT  Supplier Part Number 1: HMHA2801R2CT-ND  [SOIC127P700X220-4N]
U10  HMHA2801R2CT  Supplier Part Number 1: HMHA2801R2CT-ND  [SOIC127P700X220-4N]

### Ports
A (out), B (out), CTRL (in), DIR (in)

### Nets
5Va: P6.B9 P6.B10 P6.B11 U9.4(C) U10.4(C)
5Vd: P6.B12 P6.B13 P6.B14
DGND: P6.A12 P6.A13 P6.A14 P6.A15 P6.A16 P6.A17 P6.A18 U9.2(K) U10.2(K)
PGND: P6.A5 P6.A6 P6.A7 P6.A8 P6.A9 P6.A10 P6.A11 R30.1 R31.1
Vpower: P6.A1 P6.A2 P6.A3 P6.A4 P6.B1 P6.B2 P6.B3 P6.B4
A: P6.B15 P6.B16 ; port A
B: P6.B17 P6.B18 ; port B
CTRL: R28.1 ; port CTRL
DIR: R27.1 ; port DIR
NetP6_B5: P6.B5 P6.B6 R30.2 U10.3(E)
NetP6_B7: P6.B7 P6.B8 R31.2 U9.3(E)
NetR27_2: R27.2 U9.1(A)
NetR28_2: R28.2 U10.1(A)

### Channels
MotorInterface1: designators end in _1; ports A=A1 B=B1 CTRL=CTRL1 DIR=DIR1
MotorInterface2: designators end in _2; ports A=A2 B=B2 CTRL=CTRL2 DIR=DIR2
MotorInterface3: designators end in _3; ports A=A3 B=B3 CTRL=CTRL3 DIR=DIR3
MotorInterface4: designators end in _4; ports A=A4 B=B4 CTRL=CTRL4 DIR=DIR4

### Notes on the sheet
- Titre :
- Version :
- Fichier :
- Révision :
- Projet :
- Concepteur :
- Date :
- Page
- de

### Library data of the parts
P6 = 0877159006: CONN PCI EXPRESS 36POS 1MM GOLD
R27 R28 = RC0603JR-07390RL: as R18 on sheet Power; Supplier 1: Digi-Key; Manufacturer Part Number: RC0603JR-07390RL; RoHS: RoHS Compliant; Category: Resistors; Stock 1: 718727; Pricing 1: 1=0.15, 10=0.017, 25=0.012, 100=0.0067, 250=0.00508, 500=0.00408, 1000=0.003, 2500=0.0026 (CAD); Packaging: Cut Tape (CT); Tolerance: ±5%; Composition: Thick Film; Features: Moisture Resistant; Operating Temperature: -55°C ~ 155°C; Package / Case: 0603 (1608 Metric); Supplier Device Package: 0603; Size / Dimension: 0.063" L x 0.031" W (1.60mm x 0.80mm); Height: 0.022" (0.55mm); Number of Terminations: 2; ComponentLink1URL: http://www.yageo.com/documents/recent/PYu-RC_Group_51_RoHS_L_04.pdf; ComponentLink1Description: http://www.yageo.com/documents/recent/PYu-RC_Group_51_RoHS_L_04.pdf; Supplier Part Number 1: 311-390GRCT-ND
R30 R31 = RC0603JR-07470RL: RES SMD 470 OHM 5% 1/10W 0603; Manufacturer: Yageo; Power (Watts): 0.1W, 1/10W; Temperature Coefficient: ±100ppm/°C; Supplier 1: Digi-Key; Manufacturer Part Number: RC0603JR-07470RL; RoHS: RoHS Compliant; Category: Resistors; Stock 1: 968246; Pricing 1: 1=0.15, 10=0.017, 25=0.012, 100=0.0067, 250=0.00508, 500=0.00408, 1000=0.003, 2500=0.0026 (CAD); Packaging: Cut Tape (CT); Tolerance: ±5%; Composition: Thick Film; Features: Moisture Resistant; Operating Temperature: -55°C ~ 155°C; Package / Case: 0603 (1608 Metric); Supplier Device Package: 0603; Size / Dimension: 0.063" L x 0.031" W (1.60mm x 0.80mm); Height: 0.022" (0.55mm); Number of Terminations: 2; ComponentLink1URL: http://www.yageo.com/documents/recent/PYu-RC_Group_51_RoHS_L_04.pdf; ComponentLink1Description: http://www.yageo.com/documents/recent/PYu-RC_Group_51_RoHS_L_04.pdf; Supplier Part Number 1: 311-470GRCT-ND
U9 U10 = HMHA2801R2CT: OPTOISOLATOR 3.75KV TRANS 4-SO; Supplier 1: Digi-Key

## Sheet KickerInterface.SchDoc: Connection vers kicker
size Letter; Organization: Robocup Ulaval; DocumentNumber: 9; Revision: 1.0; SheetNumber: 9; SheetTotal: 10; Version: Gamma 1.0; Conceptor: Philippe T. Simon B. Léonard G. Alexia B-L.
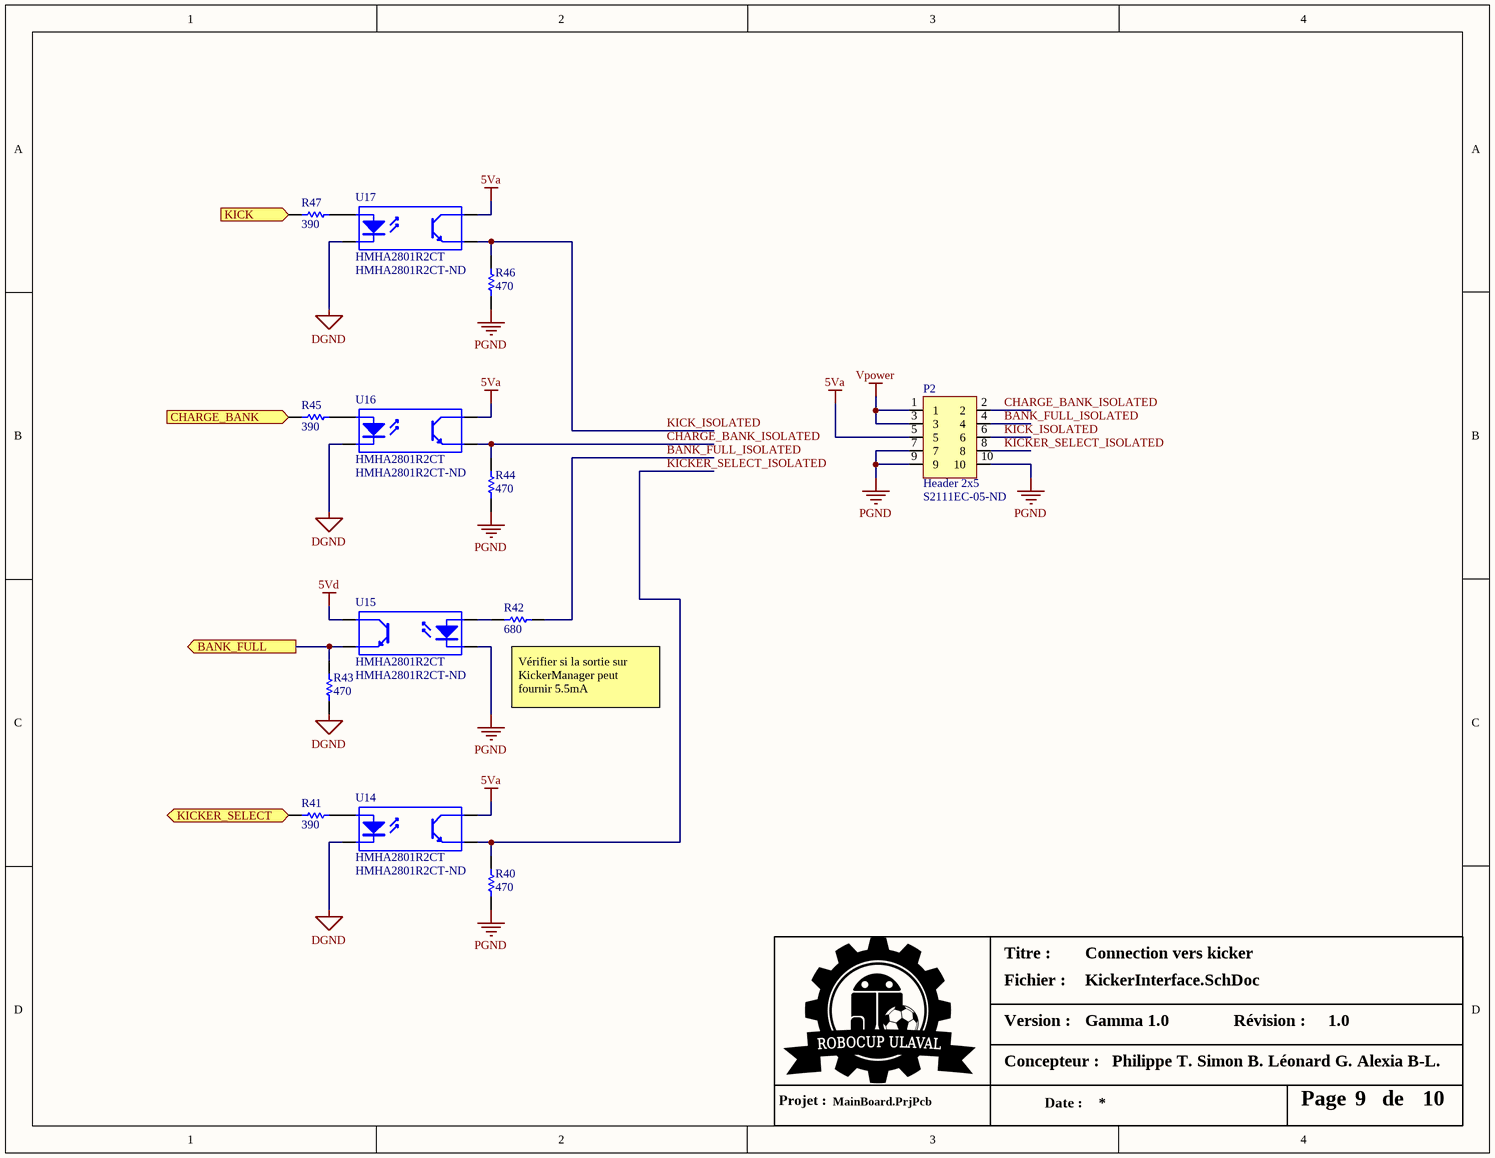
[diagram p3: KickerInterface.SchDoc]

### Parts
P2  Header 2x5  Supplier Part Number 2: S2111EC-05-ND  [HDR2x5_Right_Angle]
R40  Resistance (Ohms): 470  [0603]  (hidden comment: RC0603JR-07470RL)
R41  Resistance (Ohms): 390  [0603]  (hidden comment: RC0603JR-07390RL)
R42  Resistance (Ohms): 680  [0603]  (hidden comment: RC0603JR-07680RL)
R43  Resistance (Ohms): 470  [0603]  (hidden comment: RC0603JR-07470RL)
R44  Resistance (Ohms): 470  [0603]  (hidden comment: RC0603JR-07470RL)
R45  Resistance (Ohms): 390  [0603]  (hidden comment: RC0603JR-07390RL)
R46  Resistance (Ohms): 470  [0603]  (hidden comment: RC0603JR-07470RL)
R47  Resistance (Ohms): 390  [0603]  (hidden comment: RC0603JR-07390RL)
U14  HMHA2801R2CT  Supplier Part Number 1: HMHA2801R2CT-ND  [SOIC127P700X220-4N]
U15  HMHA2801R2CT  Supplier Part Number 1: HMHA2801R2CT-ND  [SOIC127P700X220-4N]
U16  HMHA2801R2CT  Supplier Part Number 1: HMHA2801R2CT-ND  [SOIC127P700X220-4N]
U17  HMHA2801R2CT  Supplier Part Number 1: HMHA2801R2CT-ND  [SOIC127P700X220-4N]

### Ports
BANK_FULL (out), CHARGE_BANK (in), KICK (in), KICKER_SELECT (in)

### Nets
5Va: P2.5 U14.4(C) U16.4(C) U17.4(C)
5Vd: U15.4(C)
DGND: R43.1 U14.2(K) U16.2(K) U17.2(K)
PGND: P2.7 P2.9 P2.10 R40.1 R44.1 R46.1 U15.2(K)
Vpower: P2.1 P2.3
BANK_FULL: R43.2 U15.3(E) ; port BANK_FULL
BANK_FULL_ISOLATED: P2.4 R42.2
CHARGE_BANK: R45.1 ; port CHARGE_BANK
CHARGE_BANK_ISOLATED: P2.2 R44.2 U16.3(E)
KICK: R47.1 ; port KICK
KICK_ISOLATED: P2.6 R46.2 U17.3(E)
KICKER_SELECT: R41.1 ; port KICKER_SELECT
KICKER_SELECT_ISOLATED: P2.8 R40.2 U14.3(E)
NetR41_2: R41.2 U14.1(A)
NetR42_1: R42.1 U15.1(A)
NetR45_2: R45.2 U16.1(A)
NetR47_2: R47.2 U17.1(A)

### Notes on the sheet
- (near R42) Vérifier si la sortie sur KickerManager peut fournir 5.5mA
- Titre :
- Version :
- Fichier :
- Révision :
- Projet :
- Concepteur :
- Date :
- Page
- de

### Library data of the parts
P2 = header 2x5 100mil right angle: Header 10pins 2 rows 100mil right angle; Supplier 1: Digi-Key; Supplier 2: Digi-Key
R40 R43 R44 R46 = RC0603JR-07470RL: as R30 on sheet MotorInterface; Supplier 1: Digi-Key; Manufacturer Part Number: RC0603JR-07470RL; RoHS: RoHS Compliant; Category: Resistors; Stock 1: 968246; Pricing 1: 1=0.15, 10=0.017, 25=0.012, 100=0.0067, 250=0.00508, 500=0.00408, 1000=0.003, 2500=0.0026 (CAD); Packaging: Cut Tape (CT); Tolerance: ±5%; Composition: Thick Film; Features: Moisture Resistant; Operating Temperature: -55°C ~ 155°C; Package / Case: 0603 (1608 Metric); Supplier Device Package: 0603; Size / Dimension: 0.063" L x 0.031" W (1.60mm x 0.80mm); Height: 0.022" (0.55mm); Number of Terminations: 2; ComponentLink1URL: http://www.yageo.com/documents/recent/PYu-RC_Group_51_RoHS_L_04.pdf; ComponentLink1Description: http://www.yageo.com/documents/recent/PYu-RC_Group_51_RoHS_L_04.pdf; Supplier Part Number 1: 311-470GRCT-ND
R41 R45 R47 = RC0603JR-07390RL: as R18 on sheet Power; Supplier 1: Digi-Key; Manufacturer Part Number: RC0603JR-07390RL; RoHS: RoHS Compliant; Category: Resistors; Stock 1: 718727; Pricing 1: 1=0.15, 10=0.017, 25=0.012, 100=0.0067, 250=0.00508, 500=0.00408, 1000=0.003, 2500=0.0026 (CAD); Packaging: Cut Tape (CT); Tolerance: ±5%; Composition: Thick Film; Features: Moisture Resistant; Operating Temperature: -55°C ~ 155°C; Package / Case: 0603 (1608 Metric); Supplier Device Package: 0603; Size / Dimension: 0.063" L x 0.031" W (1.60mm x 0.80mm); Height: 0.022" (0.55mm); Number of Terminations: 2; ComponentLink1URL: http://www.yageo.com/documents/recent/PYu-RC_Group_51_RoHS_L_04.pdf; ComponentLink1Description: http://www.yageo.com/documents/recent/PYu-RC_Group_51_RoHS_L_04.pdf; Supplier Part Number 1: 311-390GRCT-ND
R42 = RC0603JR-07680RL: RES SMD 680 OHM 5% 1/10W 0603; Manufacturer: Yageo; Power (Watts): 0.1W, 1/10W; Temperature Coefficient: ±100ppm/°C; Supplier 1: Digi-Key; Manufacturer Part Number: RC0603JR-07680RL; RoHS: RoHS Compliant; Category: Resistors; Stock 1: 125041; Pricing 1: 1=0.15, 10=0.017, 25=0.012, 100=0.0067, 250=0.00508, 500=0.00408, 1000=0.003, 2500=0.0026 (CAD); Packaging: Cut Tape (CT); Tolerance: ±5%; Composition: Thick Film; Features: Moisture Resistant; Operating Temperature: -55°C ~ 155°C; Package / Case: 0603 (1608 Metric); Supplier Device Package: 0603; Size / Dimension: 0.063" L x 0.031" W (1.60mm x 0.80mm); Height: 0.022" (0.55mm); Number of Terminations: 2; ComponentLink1URL: http://www.yageo.com/documents/recent/PYu-RC_Group_51_RoHS_L_04.pdf; ComponentLink1Description: http://www.yageo.com/documents/recent/PYu-RC_Group_51_RoHS_L_04.pdf; Supplier Part Number 1: 311-680GRCT-ND
U14-U17 = HMHA2801R2CT: OPTOISOLATOR 3.75KV TRANS 4-SO; Supplier 1: Digi-Key

## Sheet DribblerInterface.SchDoc: Capteurs et moteur du dribbleur
size A4; Organization: Robocup Ulaval; DocumentNumber: 3; Revision: 1.0; SheetNumber: 3; SheetTotal: 10; Conceptor: Philippe T. Simon B. Léonard G. Alexia B-L.; Version: Gamma 1.0
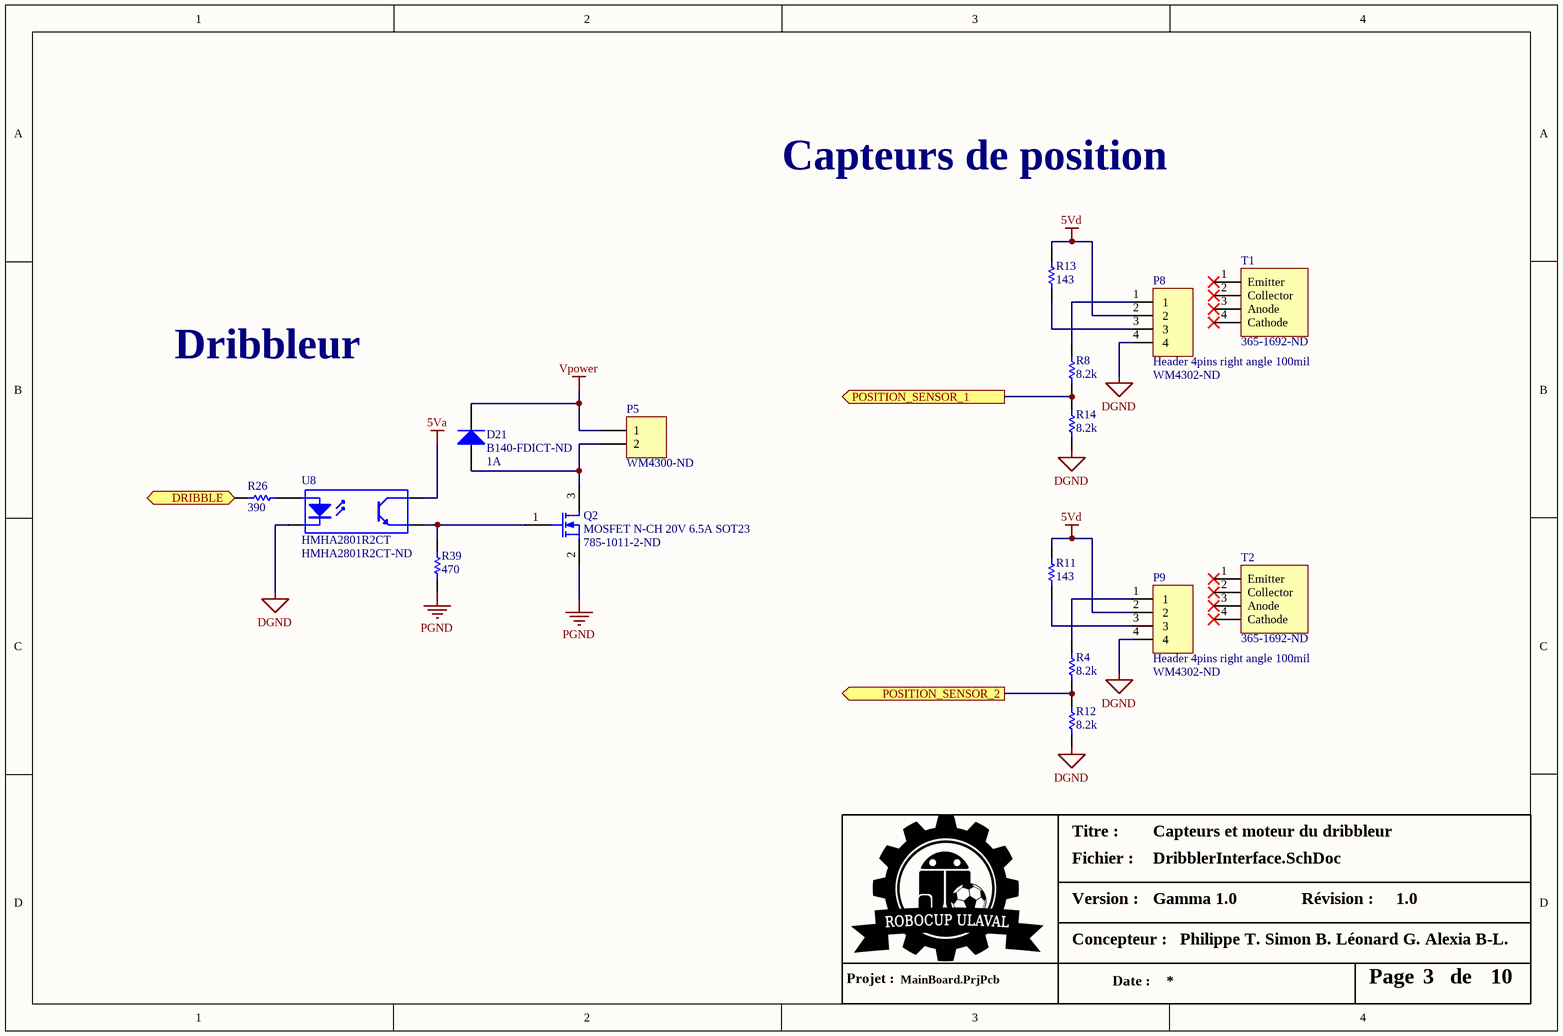
[diagram p4: DribblerInterface.SchDoc]

### Parts
D21  Supplier Part Number 1: B140-FDICT-ND  Current - Average Rectified (Io): 1A  [SMA]  (hidden comment: B140-13-F)
P5  Supplier Part Number 1: WM4300-ND  [0.156mil header right angle]  (hidden comment: Header 2 Right Angle)
P8  Header 4pins right angle 100mil  Supplier Part Number 1: WM4302-ND  [HDR1x4_Right_Angle]
P9  Header 4pins right angle 100mil  Supplier Part Number 1: WM4302-ND  [HDR1x4_Right_Angle]
Q2  MOSFET N-CH 20V 6.5A SOT23  Supplier Part Number 1: 785-1011-2-ND  [SOT-23-3]
R4  Resistance (Ohms): 8.2k  [0603]  (hidden comment: RC0603JR-078K2L)
R8  Resistance (Ohms): 8.2k  [0603]  (hidden comment: RC0603JR-078K2L)
R11  Resistance (Ohms): 143  [0603]  (hidden comment: RC0603FR-07143RL)
R12  Resistance (Ohms): 8.2k  [0603]  (hidden comment: RC0603JR-078K2L)
R13  Resistance (Ohms): 143  [0603]  (hidden comment: RC0603FR-07143RL)
R14  Resistance (Ohms): 8.2k  [0603]  (hidden comment: RC0603JR-078K2L)
R26  Resistance (Ohms): 390  [0603]  (hidden comment: RC0603JR-07390RL)
R39  Resistance (Ohms): 470  [0603]  (hidden comment: RC0603JR-07470RL)
T1  Supplier Part Number 1: 365-1692-ND  (hidden comment: OPB732WZ)
T2  Supplier Part Number 1: 365-1692-ND  (hidden comment: OPB732WZ)
U8  HMHA2801R2CT  Supplier Part Number 1: HMHA2801R2CT-ND  [SOIC127P700X220-4N]

### Ports
DRIBBLE (in), POSITION_SENSOR_1 (out), POSITION_SENSOR_2 (out)

### Nets
5Va: U8.4(C)
5Vd: P8.2 P9.2 R11.2 R13.2
DGND: P8.4 P9.4 R12.1 R14.1 U8.2(K)
PGND: Q2.2(S) R39.1
Vpower: D21.2(K) P5.1
DRIBBLE: R26.1 ; port DRIBBLE
POSITION_SENSOR_1: R8.1 R14.2 ; port POSITION_SENSOR_1
POSITION_SENSOR_2: R4.1 R12.2 ; port POSITION_SENSOR_2
NetD21_1: D21.1(A) P5.2 Q2.3(D)
NetP8_1: P8.1 R8.2
NetP8_3: P8.3 R13.1
NetP9_1: P9.1 R4.2
NetP9_3: P9.3 R11.1
NetQ2_1: Q2.1(G) R39.2 U8.3(E)
NetR26_2: R26.2 U8.1(A)

Not connected (* = marked no-connect by the designer): T1 1(Emitter)* 2(Collector)* 3(Anode)* 4(Cathode)*; T2 1(Emitter)* 2(Collector)* 3(Anode)* 4(Cathode)*

### Notes on the sheet
- Capteurs de position
- Dribbleur
- Titre :
- Version :
- Fichier :
- Révision :
- Projet :
- Concepteur :
- Date :
- Page
- de

### Library data of the parts
D21 = B140-13-F: DIODE SCHOTTKY 40V 1A SMA; Manufacturer: Diodes Incorporated; Voltage - Forward (Vf) (Max) @ If: 500mV @ 1A; Speed: Fast Recovery =< 500ns, > 200mA (Io); Current - Reverse Leakage @ Vr: 500µA @ 40V; Capacitance @ Vr, F: 110pF @ 4V, 1MHz; Supplier 1: Digi-Key; Manufacturer Part Number: B140-13-F; RoHS: RoHS Compliant; Category: Discrete Semiconductor Products; Stock 1: 278329; Pricing 1: 1=0.54, 10=0.441, 100=0.2337, 500=0.15366, 1000=0.1047 (CAD); Packaging: Cut Tape (CT); Diode Type: Schottky; Voltage - DC Reverse (Vr) (Max): 40V; Reverse Recovery Time (trr): -; Mounting Type: Surface Mount; Package / Case: DO-214AC, SMA; Supplier Device Package: SMA; Operating Temperature - Junction: -65°C ~ 150°C; ComponentLink1URL: http://www.diodes.com/_files/datasheets/ds13002.pdf; ComponentLink1Description: http://www.diodes.com/_files/datasheets/ds13002.pdf
P5 = Header 2pin 0.156 Right Angle: Header, 2-Pin, 0.156mil, Right Angle; Supplier 1: Digi-Key
Q2 = AO3416: Supplier 1: Digi-Key
R4 R8 R12 R14 = RC0603JR-078K2L: RES SMD 8.2K OHM 5% 1/10W 0603; Manufacturer: Yageo; Power (Watts): 0.1W, 1/10W; Temperature Coefficient: ±100ppm/°C; Supplier 1: Digi-Key; Supplier Part Number 1: 311-8.2KGRCT-ND; Manufacturer Part Number: RC0603JR-078K2L; RoHS: RoHS Compliant; Category: Resistors; Stock 1: 155277; Pricing 1: 1=0.15, 10=0.017, 25=0.012, 100=0.0067, 250=0.00508, 500=0.00408, 1000=0.003, 2500=0.0026 (CAD); Packaging: Cut Tape (CT); Tolerance: ±5%; Composition: Thick Film; Features: Moisture Resistant; Operating Temperature: -55°C ~ 155°C; Package / Case: 0603 (1608 Metric); Supplier Device Package: 0603; Size / Dimension: 0.063" L x 0.031" W (1.60mm x 0.80mm); Height: 0.022" (0.55mm); Number of Terminations: 2; ComponentLink1URL: http://www.yageo.com/documents/recent/PYu-RC_Group_51_RoHS_L_04.pdf; ComponentLink1Description: http://www.yageo.com/documents/recent/PYu-RC_Group_51_RoHS_L_04.pdf
R11 R13 = RC0603FR-07143RL: RES SMD 143 OHM 1% 1/10W 0603; Manufacturer: Yageo; Power (Watts): 0.1W, 1/10W; Temperature Coefficient: ±100ppm/°C; Supplier 1: Digi-Key; Manufacturer Part Number: RC0603FR-07143RL; RoHS: RoHS Compliant; Category: Resistors; Stock 1: 63239; Pricing 1: 1=0.15, 10=0.021, 25=0.0152, 100=0.0086, 250=0.0066, 500=0.00526, 1000=0.00389, 2500=0.00337 (CAD); Packaging: Cut Tape (CT); Tolerance: ±1%; Composition: Thick Film; Features: Moisture Resistant; Operating Temperature: -55°C ~ 155°C; Package / Case: 0603 (1608 Metric); Supplier Device Package: 0603; Size / Dimension: 0.063" L x 0.031" W (1.60mm x 0.80mm); Height: 0.022" (0.55mm); Number of Terminations: 2; ComponentLink1URL: http://www.yageo.com/documents/recent/PYu-RC_Group_51_RoHS_L_04.pdf; ComponentLink1Description: http://www.yageo.com/documents/recent/PYu-RC_Group_51_RoHS_L_04.pdf; Supplier Part Number 1: 311-143HRCT-ND
R26 = RC0603JR-07390RL: as R18 on sheet Power; Supplier 1: Digi-Key; Manufacturer Part Number: RC0603JR-07390RL; RoHS: RoHS Compliant; Category: Resistors; Stock 1: 718727; Pricing 1: 1=0.15, 10=0.017, 25=0.012, 100=0.0067, 250=0.00508, 500=0.00408, 1000=0.003, 2500=0.0026 (CAD); Packaging: Cut Tape (CT); Tolerance: ±5%; Composition: Thick Film; Features: Moisture Resistant; Operating Temperature: -55°C ~ 155°C; Package / Case: 0603 (1608 Metric); Supplier Device Package: 0603; Size / Dimension: 0.063" L x 0.031" W (1.60mm x 0.80mm); Height: 0.022" (0.55mm); Number of Terminations: 2; ComponentLink1URL: http://www.yageo.com/documents/recent/PYu-RC_Group_51_RoHS_L_04.pdf; ComponentLink1Description: http://www.yageo.com/documents/recent/PYu-RC_Group_51_RoHS_L_04.pdf; Supplier Part Number 1: 311-390GRCT-ND
R39 = RC0603JR-07470RL: as R30 on sheet MotorInterface; Supplier 1: Digi-Key; Manufacturer Part Number: RC0603JR-07470RL; RoHS: RoHS Compliant; Category: Resistors; Stock 1: 968246; Pricing 1: 1=0.15, 10=0.017, 25=0.012, 100=0.0067, 250=0.00508, 500=0.00408, 1000=0.003, 2500=0.0026 (CAD); Packaging: Cut Tape (CT); Tolerance: ±5%; Composition: Thick Film; Features: Moisture Resistant; Operating Temperature: -55°C ~ 155°C; Package / Case: 0603 (1608 Metric); Supplier Device Package: 0603; Size / Dimension: 0.063" L x 0.031" W (1.60mm x 0.80mm); Height: 0.022" (0.55mm); Number of Terminations: 2; ComponentLink1URL: http://www.yageo.com/documents/recent/PYu-RC_Group_51_RoHS_L_04.pdf; ComponentLink1Description: http://www.yageo.com/documents/recent/PYu-RC_Group_51_RoHS_L_04.pdf; Supplier Part Number 1: 311-470GRCT-ND
T1 T2 = OPB732WZ: SNSR OPTO TRANS 76.2MM REFL C-MT; Manufacturer: TT Electronics/Optek Technology; Sensing Distance: 3" (76.2mm); Sensing Method: Reflective; Voltage - Collector Emitter Breakdown (Max): 30V; Current - Collector (Ic) (Max): 50mA; Output Type: Phototransistor; Supplier 1: Digi-Key; Manufacturer Part Number: OPB732WZ; RoHS: RoHS Compliant; Category: Sensors, Transducers; Stock 1: 1115; Pricing 1: 1=6.54, 100=6.2843, 250=6.04264, 500=5.81512, 1000=5.6161, 2500=5.41704, 5000=5.2322 (CAD); Packaging: Bulk; Current - DC Forward (If) (Max): 50mA; Response Time: -; Mounting Type: Chassis Mount; Package / Case: Module, Pre-Wired; Operating Temperature: -40°C ~ 85°C; ComponentLink1URL: http://www.optekinc.com/datasheets/OPB732.PDF; ComponentLink1Description: http://www.optekinc.com/datasheets/OPB732.PDF
U8 = HMHA2801R2CT: OPTOISOLATOR 3.75KV TRANS 4-SO; Supplier 1: Digi-Key
P8 P9 = Header 4pins right angle 100mil: Supplier 1: Digi-Key